# Altium schematic sheet FIT_TCM_HDMI.SchDoc: FIT_TCM board
size 420 x 297 mm; CheckedBy: G.Kasprowicz; Author: INR Moscow; CompanyName: WUT ISE; DrawnBy: M.Podgórski; Organization: WUT ISE; Address1: PW ISE; Address2: Nowowiejska 15/19 00-665 Warsaw; Address3: gkasprow@gmail.com; DocumentNumber: 15; Revision: 2; SheetNumber: 22; SheetTotal: 32; ModifiedBy: -; CheckedDate: -; Title2: HDMI IN subsystem; DivGrp: WUT ISE; Designer: INR RAS; ModifiedDate: -; ProjectName: Sensor Box
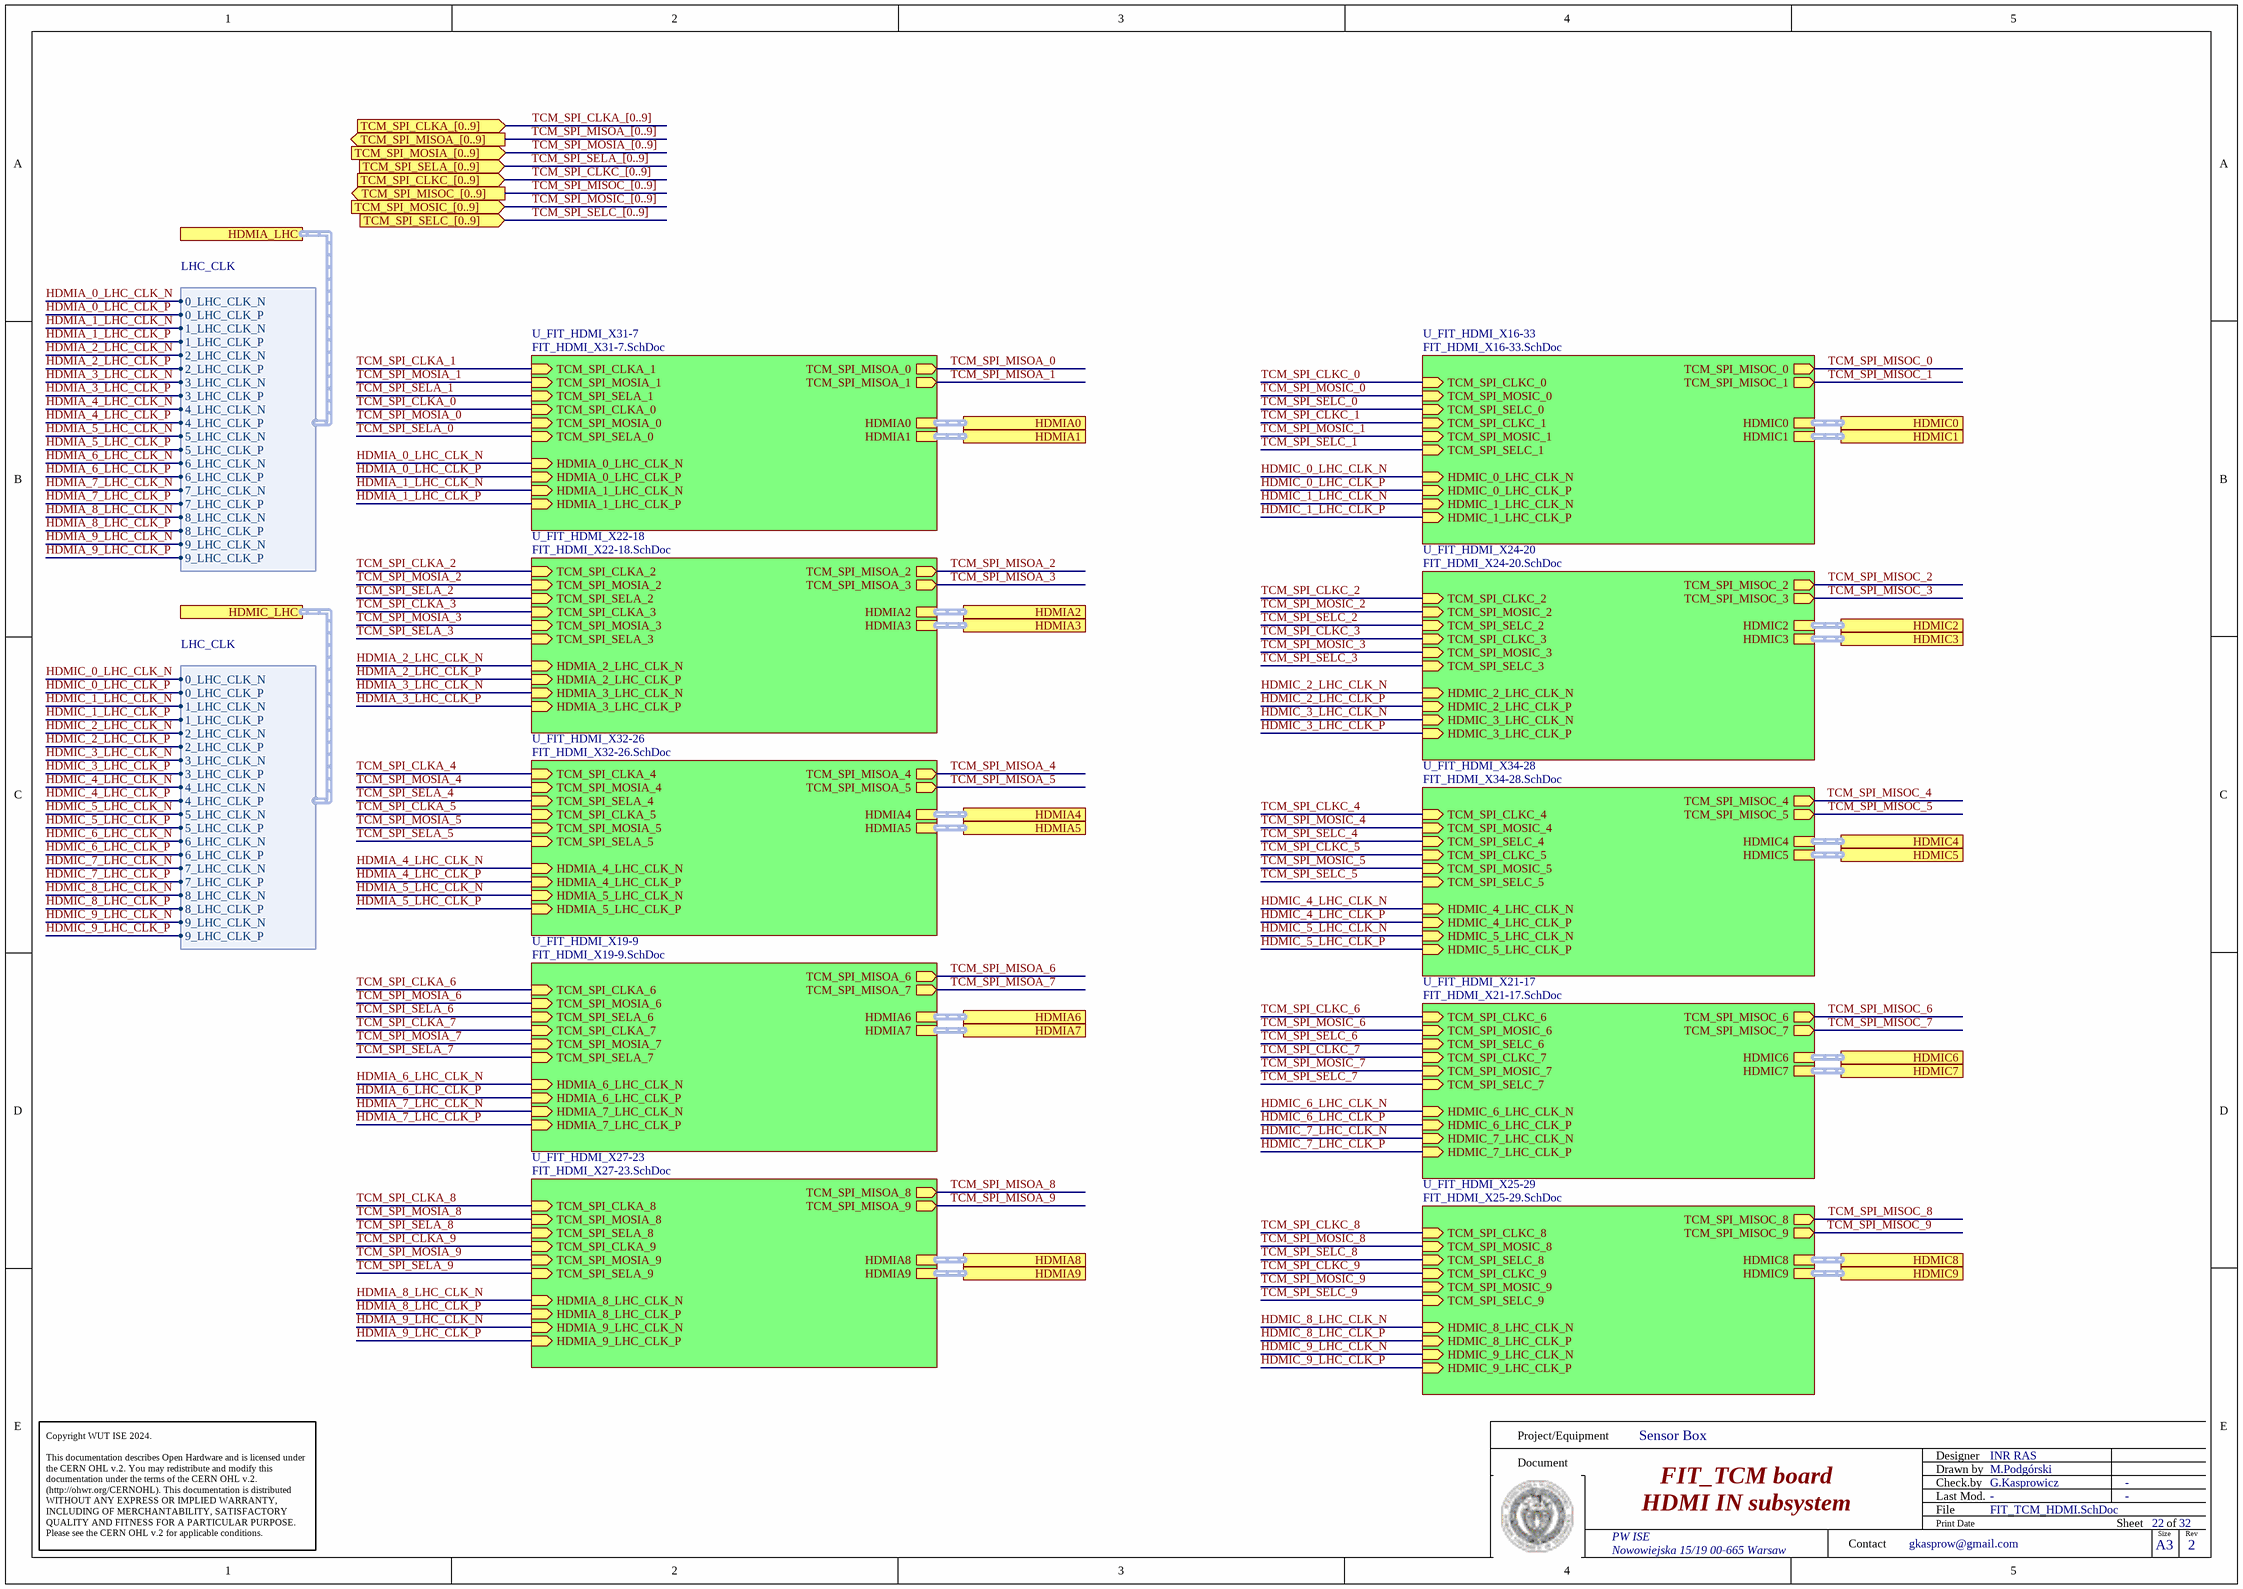
[diagram p0: FIT_TCM_HDMI.SchDoc]

## Sub-sheets
U_FIT_HDMI_X16-33 = FIT_HDMI_X16-33.SchDoc: HDMIC_0_LHC_CLK_P (in), HDMIC_0_LHC_CLK_N (in), HDMIC_1_LHC_CLK_P (in), HDMIC_1_LHC_CLK_N (in), TCM_SPI_SELC_0 (in), TCM_SPI_CLKC_0 (in), TCM_SPI_MOSIC_0 (in), TCM_SPI_MISOC_0 (out), TCM_SPI_SELC_1 (in), TCM_SPI_CLKC_1 (in), TCM_SPI_MOSIC_1 (in), TCM_SPI_MISOC_1 (out), HDMIC0 (harness HDMI_SIG), HDMIC1 (harness HDMI_SIG)
U_FIT_HDMI_X19-9 = FIT_HDMI_X19-9.SchDoc: HDMIA_7_LHC_CLK_P (in), HDMIA_7_LHC_CLK_N (in), HDMIA_6_LHC_CLK_P (in), HDMIA_6_LHC_CLK_N (in), TCM_SPI_SELA_7 (in), TCM_SPI_CLKA_7 (in), TCM_SPI_MOSIA_7 (in), TCM_SPI_MISOA_7 (out), TCM_SPI_SELA_6 (in), TCM_SPI_CLKA_6 (in), TCM_SPI_MOSIA_6 (in), TCM_SPI_MISOA_6 (out), HDMIA7 (harness HDMI_SIG), HDMIA6 (harness HDMI_SIG)
U_FIT_HDMI_X21-17 = FIT_HDMI_X21-17.SchDoc: HDMIC_6_LHC_CLK_P (in), HDMIC_6_LHC_CLK_N (in), HDMIC_7_LHC_CLK_P (in), HDMIC_7_LHC_CLK_N (in), TCM_SPI_SELC_6 (in), TCM_SPI_CLKC_6 (in), TCM_SPI_MOSIC_6 (in), TCM_SPI_MISOC_6 (out), TCM_SPI_SELC_7 (in), TCM_SPI_CLKC_7 (in), TCM_SPI_MOSIC_7 (in), TCM_SPI_MISOC_7 (out), HDMIC6 (harness HDMI_SIG), HDMIC7 (harness HDMI_SIG)
U_FIT_HDMI_X22-18 = FIT_HDMI_X22-18.SchDoc: HDMIA_2_LHC_CLK_P (in), HDMIA_2_LHC_CLK_N (in), HDMIA_3_LHC_CLK_P (in), HDMIA_3_LHC_CLK_N (in), TCM_SPI_MISOA_2 (out), TCM_SPI_MOSIA_2 (in), TCM_SPI_CLKA_2 (in), TCM_SPI_SELA_2 (in), TCM_SPI_SELA_3 (in), TCM_SPI_CLKA_3 (in), TCM_SPI_MOSIA_3 (in), TCM_SPI_MISOA_3 (out), HDMIA2 (harness HDMI_SIG), HDMIA3 (harness HDMI_SIG)
U_FIT_HDMI_X24-20 = FIT_HDMI_X24-20.SchDoc: HDMIC_2_LHC_CLK_P (in), HDMIC_2_LHC_CLK_N (in), HDMIC_3_LHC_CLK_P (in), HDMIC_3_LHC_CLK_N (in), TCM_SPI_SELC_2 (in), TCM_SPI_CLKC_2 (in), TCM_SPI_MOSIC_2 (in), TCM_SPI_MISOC_2 (out), TCM_SPI_SELC_3 (in), TCM_SPI_CLKC_3 (in), TCM_SPI_MOSIC_3 (in), TCM_SPI_MISOC_3 (out), HDMIC2 (harness HDMI_SIG), HDMIC3 (harness HDMI_SIG)
U_FIT_HDMI_X25-29 = FIT_HDMI_X25-29.SchDoc: HDMIC_8_LHC_CLK_P (in), HDMIC_8_LHC_CLK_N (in), TCM_SPI_SELC_8 (in), TCM_SPI_CLKC_8 (in), TCM_SPI_MOSIC_8 (in), TCM_SPI_MISOC_8 (out), HDMIC_9_LHC_CLK_P (in), HDMIC_9_LHC_CLK_N (in), TCM_SPI_SELC_9 (in), TCM_SPI_CLKC_9 (in), TCM_SPI_MOSIC_9 (in), TCM_SPI_MISOC_9 (out), HDMIC8 (harness HDMI_SIG), HDMIC9 (harness HDMI_SIG)
U_FIT_HDMI_X27-23 = FIT_HDMI_X27-23.SchDoc: HDMIA_8_LHC_CLK_P (in), HDMIA_8_LHC_CLK_N (in), HDMIA_9_LHC_CLK_P (in), HDMIA_9_LHC_CLK_N (in), TCM_SPI_SELA_8 (in), TCM_SPI_CLKA_8 (in), TCM_SPI_MOSIA_8 (in), TCM_SPI_MISOA_8 (out), TCM_SPI_SELA_9 (in), TCM_SPI_CLKA_9 (in), TCM_SPI_MOSIA_9 (in), TCM_SPI_MISOA_9 (out), HDMIA8 (harness HDMI_SIG), HDMIA9 (harness HDMI_SIG)
U_FIT_HDMI_X31-7 = FIT_HDMI_X31-7.SchDoc: HDMIA_1_LHC_CLK_P (in), HDMIA_1_LHC_CLK_N (in), HDMIA_0_LHC_CLK_P (in), HDMIA_0_LHC_CLK_N (in), TCM_SPI_CLKA_1 (in), TCM_SPI_SELA_1 (in), TCM_SPI_MOSIA_1 (in), TCM_SPI_MISOA_1 (out), TCM_SPI_MISOA_0 (out), TCM_SPI_MOSIA_0 (in), TCM_SPI_CLKA_0 (in), TCM_SPI_SELA_0 (in), HDMIA1 (harness HDMI_SIG), HDMIA0 (harness HDMI_SIG)
U_FIT_HDMI_X32-26 = FIT_HDMI_X32-26.SchDoc: HDMIA_5_LHC_CLK_P (in), HDMIA_5_LHC_CLK_N (in), HDMIA_4_LHC_CLK_P (in), HDMIA_4_LHC_CLK_N (in), TCM_SPI_SELA_4 (in), TCM_SPI_CLKA_4 (in), TCM_SPI_MOSIA_4 (in), TCM_SPI_MISOA_4 (out), TCM_SPI_SELA_5 (in), TCM_SPI_CLKA_5 (in), TCM_SPI_MOSIA_5 (in), TCM_SPI_MISOA_5 (out), HDMIA4 (harness HDMI_SIG), HDMIA5 (harness HDMI_SIG)
U_FIT_HDMI_X34-28 = FIT_HDMI_X34-28.SchDoc: HDMIC_5_LHC_CLK_P (in), HDMIC_5_LHC_CLK_N (in), HDMIC_4_LHC_CLK_P (in), HDMIC_4_LHC_CLK_N (in), TCM_SPI_SELC_5 (in), TCM_SPI_CLKC_5 (in), TCM_SPI_MOSIC_5 (in), TCM_SPI_MISOC_5 (out), TCM_SPI_SELC_4 (in), TCM_SPI_CLKC_4 (in), TCM_SPI_MOSIC_4 (in), TCM_SPI_MISOC_4 (out), HDMIC5 (harness HDMI_SIG), HDMIC4 (harness HDMI_SIG)

## Ports
HDMIA0 (harness HDMI_SIG), HDMIA1 (harness HDMI_SIG), HDMIA2 (harness HDMI_SIG), HDMIA3 (harness HDMI_SIG), HDMIA4 (harness HDMI_SIG), HDMIA5 (harness HDMI_SIG), HDMIA6 (harness HDMI_SIG), HDMIA7 (harness HDMI_SIG), HDMIA8 (harness HDMI_SIG), HDMIA9 (harness HDMI_SIG), HDMIA_LHC (harness LHC_CLK), HDMIC0 (harness HDMI_SIG), HDMIC1 (harness HDMI_SIG), HDMIC2 (harness HDMI_SIG), HDMIC3 (harness HDMI_SIG), HDMIC4 (harness HDMI_SIG), HDMIC5 (harness HDMI_SIG), HDMIC6 (harness HDMI_SIG), HDMIC7 (harness HDMI_SIG), HDMIC8 (harness HDMI_SIG), HDMIC9 (harness HDMI_SIG), HDMIC_LHC (harness LHC_CLK), TCM_SPI_CLKA_[0..9] (in), TCM_SPI_CLKC_[0..9] (in), TCM_SPI_MISOA_[0..9] (out), TCM_SPI_MISOC_[0..9] (out), TCM_SPI_MOSIA_[0..9] (in), TCM_SPI_MOSIC_[0..9] (in), TCM_SPI_SELA_[0..9] (in), TCM_SPI_SELC_[0..9] (in)

## Harnesses
LHC_CLK: 0_LHC_CLK_N, 0_LHC_CLK_P, 1_LHC_CLK_N, 1_LHC_CLK_P, 2_LHC_CLK_N, 2_LHC_CLK_P, 3_LHC_CLK_N, 4_LHC_CLK_N, 3_LHC_CLK_P, 4_LHC_CLK_P, 5_LHC_CLK_N, 5_LHC_CLK_P, 6_LHC_CLK_N, 6_LHC_CLK_P, 7_LHC_CLK_N, 7_LHC_CLK_P, 8_LHC_CLK_N, 8_LHC_CLK_P, 9_LHC_CLK_N, 9_LHC_CLK_P

## Nets
HDMIA_0_LHC_CLK_N: sheet U_FIT_HDMI_X31-7/HDMIA_0_LHC_CLK_N, port HDMIA_LHC.0_LHC_CLK_N
HDMIA_0_LHC_CLK_P: sheet U_FIT_HDMI_X31-7/HDMIA_0_LHC_CLK_P, port HDMIA_LHC.0_LHC_CLK_P
HDMIA_1_LHC_CLK_N: sheet U_FIT_HDMI_X31-7/HDMIA_1_LHC_CLK_N, port HDMIA_LHC.1_LHC_CLK_N
HDMIA_1_LHC_CLK_P: sheet U_FIT_HDMI_X31-7/HDMIA_1_LHC_CLK_P, port HDMIA_LHC.1_LHC_CLK_P
HDMIA_2_LHC_CLK_N: sheet U_FIT_HDMI_X22-18/HDMIA_2_LHC_CLK_N, port HDMIA_LHC.2_LHC_CLK_N
HDMIA_2_LHC_CLK_P: sheet U_FIT_HDMI_X22-18/HDMIA_2_LHC_CLK_P, port HDMIA_LHC.2_LHC_CLK_P
HDMIA_3_LHC_CLK_N: sheet U_FIT_HDMI_X22-18/HDMIA_3_LHC_CLK_N, port HDMIA_LHC.3_LHC_CLK_N
HDMIA_3_LHC_CLK_P: sheet U_FIT_HDMI_X22-18/HDMIA_3_LHC_CLK_P, port HDMIA_LHC.3_LHC_CLK_P
HDMIA_4_LHC_CLK_N: sheet U_FIT_HDMI_X32-26/HDMIA_4_LHC_CLK_N, port HDMIA_LHC.4_LHC_CLK_N
HDMIA_4_LHC_CLK_P: sheet U_FIT_HDMI_X32-26/HDMIA_4_LHC_CLK_P, port HDMIA_LHC.4_LHC_CLK_P
HDMIA_5_LHC_CLK_N: sheet U_FIT_HDMI_X32-26/HDMIA_5_LHC_CLK_N, port HDMIA_LHC.5_LHC_CLK_N
HDMIA_5_LHC_CLK_P: sheet U_FIT_HDMI_X32-26/HDMIA_5_LHC_CLK_P, port HDMIA_LHC.5_LHC_CLK_P
HDMIA_6_LHC_CLK_N: sheet U_FIT_HDMI_X19-9/HDMIA_6_LHC_CLK_N, port HDMIA_LHC.6_LHC_CLK_N
HDMIA_6_LHC_CLK_P: sheet U_FIT_HDMI_X19-9/HDMIA_6_LHC_CLK_P, port HDMIA_LHC.6_LHC_CLK_P
HDMIA_7_LHC_CLK_N: sheet U_FIT_HDMI_X19-9/HDMIA_7_LHC_CLK_N, port HDMIA_LHC.7_LHC_CLK_N
HDMIA_7_LHC_CLK_P: sheet U_FIT_HDMI_X19-9/HDMIA_7_LHC_CLK_P, port HDMIA_LHC.7_LHC_CLK_P
HDMIA_8_LHC_CLK_N: sheet U_FIT_HDMI_X27-23/HDMIA_8_LHC_CLK_N, port HDMIA_LHC.8_LHC_CLK_N
HDMIA_8_LHC_CLK_P: sheet U_FIT_HDMI_X27-23/HDMIA_8_LHC_CLK_P, port HDMIA_LHC.8_LHC_CLK_P
HDMIA_9_LHC_CLK_N: sheet U_FIT_HDMI_X27-23/HDMIA_9_LHC_CLK_N, port HDMIA_LHC.9_LHC_CLK_N
HDMIA_9_LHC_CLK_P: sheet U_FIT_HDMI_X27-23/HDMIA_9_LHC_CLK_P, port HDMIA_LHC.9_LHC_CLK_P
HDMIC_0_LHC_CLK_N: sheet U_FIT_HDMI_X16-33/HDMIC_0_LHC_CLK_N, port HDMIC_LHC.0_LHC_CLK_N
HDMIC_0_LHC_CLK_P: sheet U_FIT_HDMI_X16-33/HDMIC_0_LHC_CLK_P, port HDMIC_LHC.0_LHC_CLK_P
HDMIC_1_LHC_CLK_N: sheet U_FIT_HDMI_X16-33/HDMIC_1_LHC_CLK_N, port HDMIC_LHC.1_LHC_CLK_N
HDMIC_1_LHC_CLK_P: sheet U_FIT_HDMI_X16-33/HDMIC_1_LHC_CLK_P, port HDMIC_LHC.1_LHC_CLK_P
HDMIC_2_LHC_CLK_N: sheet U_FIT_HDMI_X24-20/HDMIC_2_LHC_CLK_N, port HDMIC_LHC.2_LHC_CLK_N
HDMIC_2_LHC_CLK_P: sheet U_FIT_HDMI_X24-20/HDMIC_2_LHC_CLK_P, port HDMIC_LHC.2_LHC_CLK_P
HDMIC_3_LHC_CLK_N: sheet U_FIT_HDMI_X24-20/HDMIC_3_LHC_CLK_N, port HDMIC_LHC.3_LHC_CLK_N
HDMIC_3_LHC_CLK_P: sheet U_FIT_HDMI_X24-20/HDMIC_3_LHC_CLK_P, port HDMIC_LHC.3_LHC_CLK_P
HDMIC_4_LHC_CLK_N: sheet U_FIT_HDMI_X34-28/HDMIC_4_LHC_CLK_N, port HDMIC_LHC.4_LHC_CLK_N
HDMIC_4_LHC_CLK_P: sheet U_FIT_HDMI_X34-28/HDMIC_4_LHC_CLK_P, port HDMIC_LHC.4_LHC_CLK_P
HDMIC_5_LHC_CLK_N: sheet U_FIT_HDMI_X34-28/HDMIC_5_LHC_CLK_N, port HDMIC_LHC.5_LHC_CLK_N
HDMIC_5_LHC_CLK_P: sheet U_FIT_HDMI_X34-28/HDMIC_5_LHC_CLK_P, port HDMIC_LHC.5_LHC_CLK_P
HDMIC_6_LHC_CLK_N: sheet U_FIT_HDMI_X21-17/HDMIC_6_LHC_CLK_N, port HDMIC_LHC.6_LHC_CLK_N
HDMIC_6_LHC_CLK_P: sheet U_FIT_HDMI_X21-17/HDMIC_6_LHC_CLK_P, port HDMIC_LHC.6_LHC_CLK_P
HDMIC_7_LHC_CLK_N: sheet U_FIT_HDMI_X21-17/HDMIC_7_LHC_CLK_N, port HDMIC_LHC.7_LHC_CLK_N
HDMIC_7_LHC_CLK_P: sheet U_FIT_HDMI_X21-17/HDMIC_7_LHC_CLK_P, port HDMIC_LHC.7_LHC_CLK_P
HDMIC_8_LHC_CLK_N: sheet U_FIT_HDMI_X25-29/HDMIC_8_LHC_CLK_N, port HDMIC_LHC.8_LHC_CLK_N
HDMIC_8_LHC_CLK_P: sheet U_FIT_HDMI_X25-29/HDMIC_8_LHC_CLK_P, port HDMIC_LHC.8_LHC_CLK_P
HDMIC_9_LHC_CLK_N: sheet U_FIT_HDMI_X25-29/HDMIC_9_LHC_CLK_N, port HDMIC_LHC.9_LHC_CLK_N
HDMIC_9_LHC_CLK_P: sheet U_FIT_HDMI_X25-29/HDMIC_9_LHC_CLK_P, port HDMIC_LHC.9_LHC_CLK_P
TCM_SPI_CLKA_0: sheet U_FIT_HDMI_X31-7/TCM_SPI_CLKA_0
TCM_SPI_CLKA_1: sheet U_FIT_HDMI_X31-7/TCM_SPI_CLKA_1
TCM_SPI_CLKA_2: sheet U_FIT_HDMI_X22-18/TCM_SPI_CLKA_2
TCM_SPI_CLKA_3: sheet U_FIT_HDMI_X22-18/TCM_SPI_CLKA_3
TCM_SPI_CLKA_4: sheet U_FIT_HDMI_X32-26/TCM_SPI_CLKA_4
TCM_SPI_CLKA_5: sheet U_FIT_HDMI_X32-26/TCM_SPI_CLKA_5
TCM_SPI_CLKA_6: sheet U_FIT_HDMI_X19-9/TCM_SPI_CLKA_6
TCM_SPI_CLKA_7: sheet U_FIT_HDMI_X19-9/TCM_SPI_CLKA_7
TCM_SPI_CLKA_8: sheet U_FIT_HDMI_X27-23/TCM_SPI_CLKA_8
TCM_SPI_CLKA_9: sheet U_FIT_HDMI_X27-23/TCM_SPI_CLKA_9
TCM_SPI_CLKC_0: sheet U_FIT_HDMI_X16-33/TCM_SPI_CLKC_0
TCM_SPI_CLKC_1: sheet U_FIT_HDMI_X16-33/TCM_SPI_CLKC_1
TCM_SPI_CLKC_2: sheet U_FIT_HDMI_X24-20/TCM_SPI_CLKC_2
TCM_SPI_CLKC_3: sheet U_FIT_HDMI_X24-20/TCM_SPI_CLKC_3
TCM_SPI_CLKC_4: sheet U_FIT_HDMI_X34-28/TCM_SPI_CLKC_4
TCM_SPI_CLKC_5: sheet U_FIT_HDMI_X34-28/TCM_SPI_CLKC_5
TCM_SPI_CLKC_6: sheet U_FIT_HDMI_X21-17/TCM_SPI_CLKC_6
TCM_SPI_CLKC_7: sheet U_FIT_HDMI_X21-17/TCM_SPI_CLKC_7
TCM_SPI_CLKC_8: sheet U_FIT_HDMI_X25-29/TCM_SPI_CLKC_8
TCM_SPI_CLKC_9: sheet U_FIT_HDMI_X25-29/TCM_SPI_CLKC_9
TCM_SPI_MISOA_0: sheet U_FIT_HDMI_X31-7/TCM_SPI_MISOA_0
TCM_SPI_MISOA_1: sheet U_FIT_HDMI_X31-7/TCM_SPI_MISOA_1
TCM_SPI_MISOA_2: sheet U_FIT_HDMI_X22-18/TCM_SPI_MISOA_2
TCM_SPI_MISOA_3: sheet U_FIT_HDMI_X22-18/TCM_SPI_MISOA_3
TCM_SPI_MISOA_4: sheet U_FIT_HDMI_X32-26/TCM_SPI_MISOA_4
TCM_SPI_MISOA_5: sheet U_FIT_HDMI_X32-26/TCM_SPI_MISOA_5
TCM_SPI_MISOA_6: sheet U_FIT_HDMI_X19-9/TCM_SPI_MISOA_6
TCM_SPI_MISOA_7: sheet U_FIT_HDMI_X19-9/TCM_SPI_MISOA_7
TCM_SPI_MISOA_8: sheet U_FIT_HDMI_X27-23/TCM_SPI_MISOA_8
TCM_SPI_MISOA_9: sheet U_FIT_HDMI_X27-23/TCM_SPI_MISOA_9
TCM_SPI_MISOC_0: sheet U_FIT_HDMI_X16-33/TCM_SPI_MISOC_0
TCM_SPI_MISOC_1: sheet U_FIT_HDMI_X16-33/TCM_SPI_MISOC_1
TCM_SPI_MISOC_2: sheet U_FIT_HDMI_X24-20/TCM_SPI_MISOC_2
TCM_SPI_MISOC_3: sheet U_FIT_HDMI_X24-20/TCM_SPI_MISOC_3
TCM_SPI_MISOC_4: sheet U_FIT_HDMI_X34-28/TCM_SPI_MISOC_4
TCM_SPI_MISOC_5: sheet U_FIT_HDMI_X34-28/TCM_SPI_MISOC_5
TCM_SPI_MISOC_6: sheet U_FIT_HDMI_X21-17/TCM_SPI_MISOC_6
TCM_SPI_MISOC_7: sheet U_FIT_HDMI_X21-17/TCM_SPI_MISOC_7
TCM_SPI_MISOC_8: sheet U_FIT_HDMI_X25-29/TCM_SPI_MISOC_8
TCM_SPI_MISOC_9: sheet U_FIT_HDMI_X25-29/TCM_SPI_MISOC_9
TCM_SPI_MOSIA_0: sheet U_FIT_HDMI_X31-7/TCM_SPI_MOSIA_0
TCM_SPI_MOSIA_1: sheet U_FIT_HDMI_X31-7/TCM_SPI_MOSIA_1
TCM_SPI_MOSIA_2: sheet U_FIT_HDMI_X22-18/TCM_SPI_MOSIA_2
TCM_SPI_MOSIA_3: sheet U_FIT_HDMI_X22-18/TCM_SPI_MOSIA_3
TCM_SPI_MOSIA_4: sheet U_FIT_HDMI_X32-26/TCM_SPI_MOSIA_4
TCM_SPI_MOSIA_5: sheet U_FIT_HDMI_X32-26/TCM_SPI_MOSIA_5
TCM_SPI_MOSIA_6: sheet U_FIT_HDMI_X19-9/TCM_SPI_MOSIA_6
TCM_SPI_MOSIA_7: sheet U_FIT_HDMI_X19-9/TCM_SPI_MOSIA_7
TCM_SPI_MOSIA_8: sheet U_FIT_HDMI_X27-23/TCM_SPI_MOSIA_8
TCM_SPI_MOSIA_9: sheet U_FIT_HDMI_X27-23/TCM_SPI_MOSIA_9
TCM_SPI_MOSIC_0: sheet U_FIT_HDMI_X16-33/TCM_SPI_MOSIC_0
TCM_SPI_MOSIC_1: sheet U_FIT_HDMI_X16-33/TCM_SPI_MOSIC_1
TCM_SPI_MOSIC_2: sheet U_FIT_HDMI_X24-20/TCM_SPI_MOSIC_2
TCM_SPI_MOSIC_3: sheet U_FIT_HDMI_X24-20/TCM_SPI_MOSIC_3
TCM_SPI_MOSIC_4: sheet U_FIT_HDMI_X34-28/TCM_SPI_MOSIC_4
TCM_SPI_MOSIC_5: sheet U_FIT_HDMI_X34-28/TCM_SPI_MOSIC_5
TCM_SPI_MOSIC_6: sheet U_FIT_HDMI_X21-17/TCM_SPI_MOSIC_6
TCM_SPI_MOSIC_7: sheet U_FIT_HDMI_X21-17/TCM_SPI_MOSIC_7
TCM_SPI_MOSIC_8: sheet U_FIT_HDMI_X25-29/TCM_SPI_MOSIC_8
TCM_SPI_MOSIC_9: sheet U_FIT_HDMI_X25-29/TCM_SPI_MOSIC_9
TCM_SPI_SELA_0: sheet U_FIT_HDMI_X31-7/TCM_SPI_SELA_0
TCM_SPI_SELA_1: sheet U_FIT_HDMI_X31-7/TCM_SPI_SELA_1
TCM_SPI_SELA_2: sheet U_FIT_HDMI_X22-18/TCM_SPI_SELA_2
TCM_SPI_SELA_3: sheet U_FIT_HDMI_X22-18/TCM_SPI_SELA_3
TCM_SPI_SELA_4: sheet U_FIT_HDMI_X32-26/TCM_SPI_SELA_4
TCM_SPI_SELA_5: sheet U_FIT_HDMI_X32-26/TCM_SPI_SELA_5
TCM_SPI_SELA_6: sheet U_FIT_HDMI_X19-9/TCM_SPI_SELA_6
TCM_SPI_SELA_7: sheet U_FIT_HDMI_X19-9/TCM_SPI_SELA_7
TCM_SPI_SELA_8: sheet U_FIT_HDMI_X27-23/TCM_SPI_SELA_8
TCM_SPI_SELA_9: sheet U_FIT_HDMI_X27-23/TCM_SPI_SELA_9
TCM_SPI_SELC_0: sheet U_FIT_HDMI_X16-33/TCM_SPI_SELC_0
TCM_SPI_SELC_1: sheet U_FIT_HDMI_X16-33/TCM_SPI_SELC_1
TCM_SPI_SELC_2: sheet U_FIT_HDMI_X24-20/TCM_SPI_SELC_2
TCM_SPI_SELC_3: sheet U_FIT_HDMI_X24-20/TCM_SPI_SELC_3
TCM_SPI_SELC_4: sheet U_FIT_HDMI_X34-28/TCM_SPI_SELC_4
TCM_SPI_SELC_5: sheet U_FIT_HDMI_X34-28/TCM_SPI_SELC_5
TCM_SPI_SELC_6: sheet U_FIT_HDMI_X21-17/TCM_SPI_SELC_6
TCM_SPI_SELC_7: sheet U_FIT_HDMI_X21-17/TCM_SPI_SELC_7
TCM_SPI_SELC_8: sheet U_FIT_HDMI_X25-29/TCM_SPI_SELC_8
TCM_SPI_SELC_9: sheet U_FIT_HDMI_X25-29/TCM_SPI_SELC_9

## Buses and harness runs
bus TCM_SPI_CLKA_[0..9] = port TCM_SPI_CLKA_[0..9]
bus TCM_SPI_CLKC_[0..9] = port TCM_SPI_CLKC_[0..9]
bus TCM_SPI_MISOA_[0..9] = port TCM_SPI_MISOA_[0..9]
bus TCM_SPI_MISOC_[0..9] = port TCM_SPI_MISOC_[0..9]
bus TCM_SPI_MOSIA_[0..9] = port TCM_SPI_MOSIA_[0..9]
bus TCM_SPI_MOSIC_[0..9] = port TCM_SPI_MOSIC_[0..9]
bus TCM_SPI_SELA_[0..9] = port TCM_SPI_SELA_[0..9]
bus TCM_SPI_SELC_[0..9] = port TCM_SPI_SELC_[0..9]
harness port HDMIA0 = sheet U_FIT_HDMI_X31-7/HDMIA0
harness port HDMIA1 = sheet U_FIT_HDMI_X31-7/HDMIA1
harness port HDMIA2 = sheet U_FIT_HDMI_X22-18/HDMIA2
harness port HDMIA3 = sheet U_FIT_HDMI_X22-18/HDMIA3
harness port HDMIA4 = sheet U_FIT_HDMI_X32-26/HDMIA4
harness port HDMIA5 = sheet U_FIT_HDMI_X32-26/HDMIA5
harness port HDMIA6 = sheet U_FIT_HDMI_X19-9/HDMIA6
harness port HDMIA7 = sheet U_FIT_HDMI_X19-9/HDMIA7
harness port HDMIA8 = sheet U_FIT_HDMI_X27-23/HDMIA8
harness port HDMIA9 = sheet U_FIT_HDMI_X27-23/HDMIA9
harness port HDMIC0 = sheet U_FIT_HDMI_X16-33/HDMIC0
harness port HDMIC1 = sheet U_FIT_HDMI_X16-33/HDMIC1
harness port HDMIC2 = sheet U_FIT_HDMI_X24-20/HDMIC2
harness port HDMIC3 = sheet U_FIT_HDMI_X24-20/HDMIC3
harness port HDMIC4 = sheet U_FIT_HDMI_X34-28/HDMIC4
harness port HDMIC5 = sheet U_FIT_HDMI_X34-28/HDMIC5
harness port HDMIC6 = sheet U_FIT_HDMI_X21-17/HDMIC6
harness port HDMIC7 = sheet U_FIT_HDMI_X21-17/HDMIC7
harness port HDMIC8 = sheet U_FIT_HDMI_X25-29/HDMIC8
harness port HDMIC9 = sheet U_FIT_HDMI_X25-29/HDMIC9

## Notes on the sheet
- Project/Equipment
- Document
- Designer
- Drawn by
- Check.by
- Copyright WUT ISE 2024.
  This documentation describes Open Hardware and is licensed under the CERN OHL v.2. You may redistribute and modify this documentation under the terms of the CERN OHL v.2. (http://ohwr.org/CERNOHL). This documentation is distributed WITHOUT ANY EXPRESS OR IMPLIED WARRANTY, INCLUDING OF MERCHANTABILITY, SATISFACTORY QUALITY AND FITNESS FOR A PARTICULAR PURPOSE. Please see the CERN OHL v.2 for applicable conditions.
- Contact
- File
- Last Mod.
- Print Date
- Sheet
- Size
- A3
- of
- Rev